# EAGLE design OSO-MISC-20-017 Parallel E-Paper Test Board 2 (EAGLE 9.6.2)
COMPANY: ADAFRUIT INDUSTRIES; DRAWN: KTOWN; REV: B
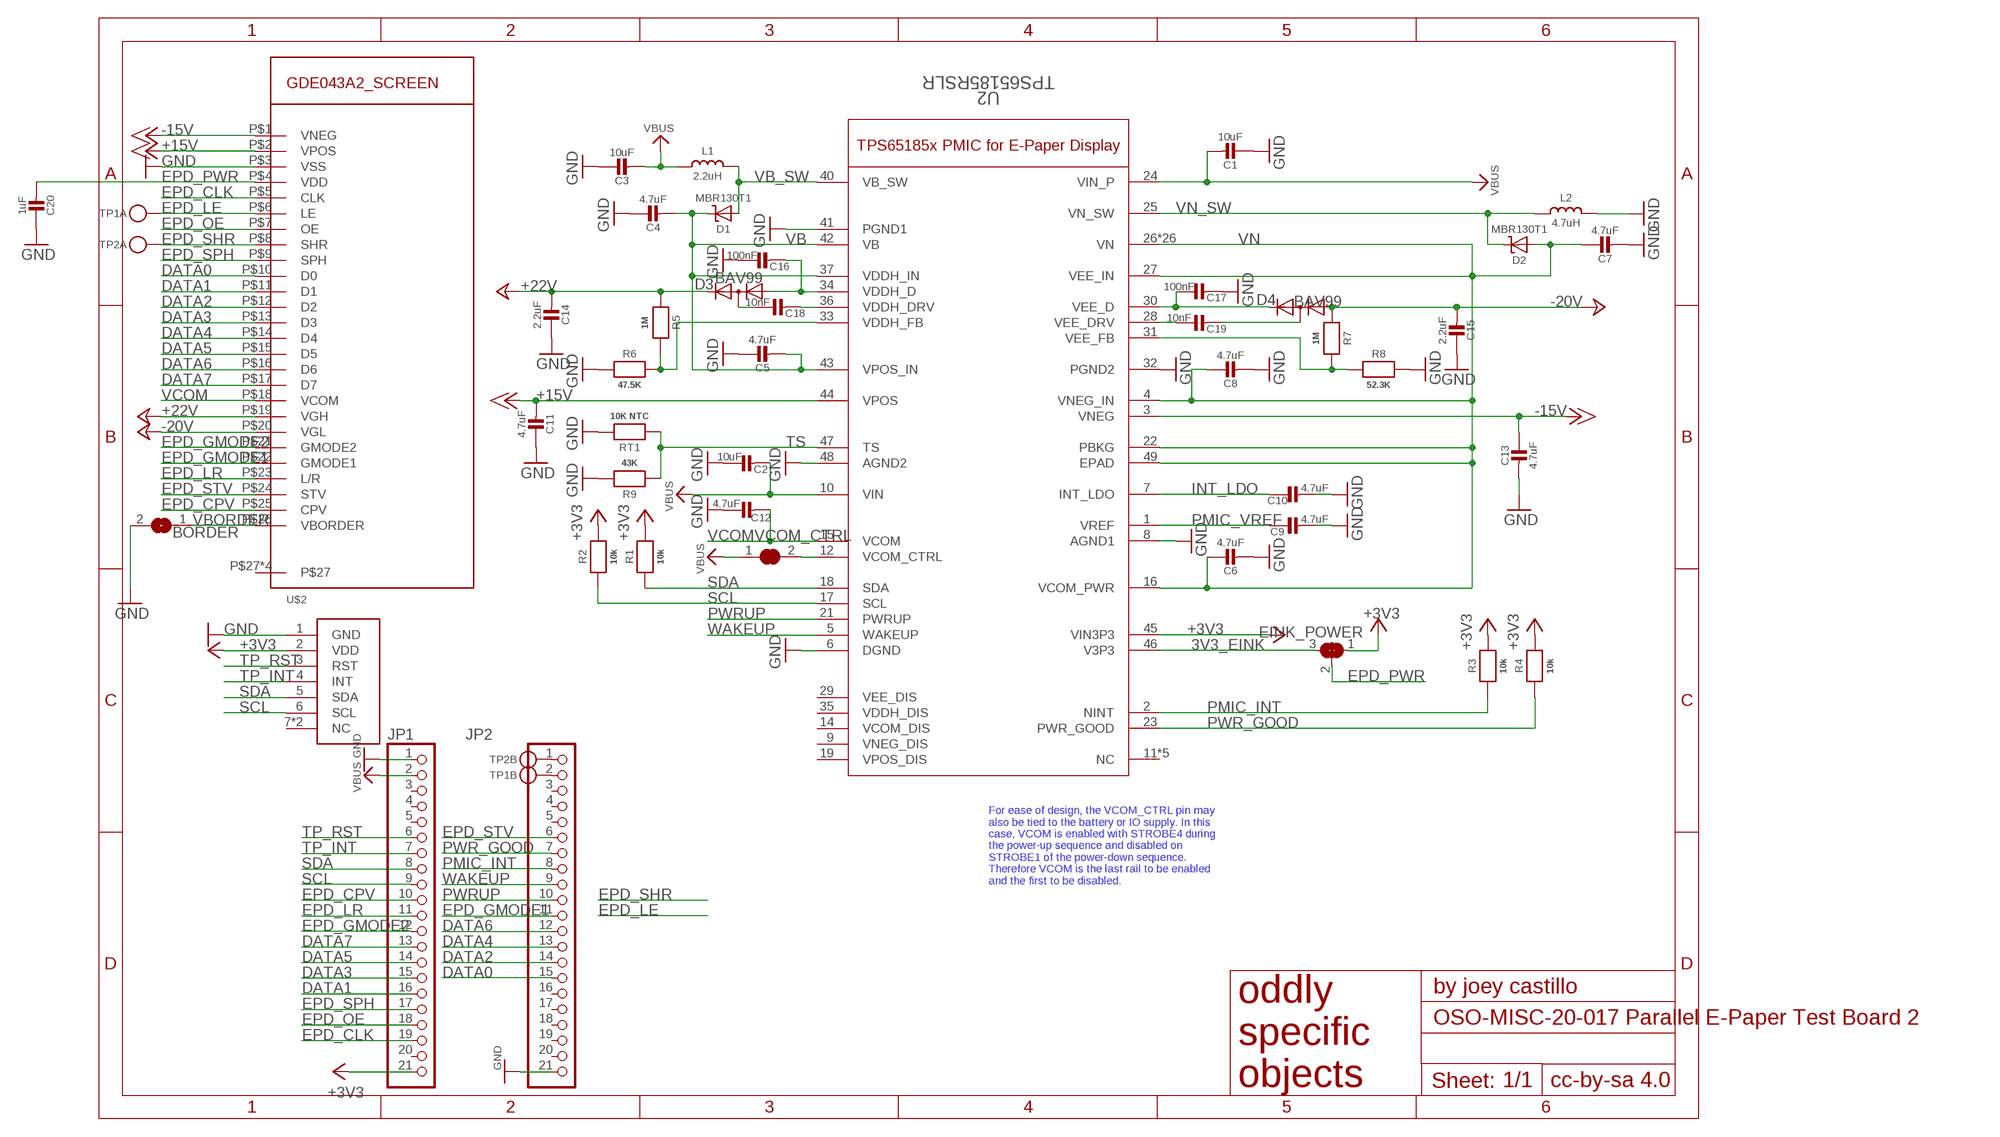
[diagram p0: schematic, sheet 1]

## Parts
BORDER  SJ  [SJ]
C1  10uF  CAP_CERAMIC0805-NOOUTLINE  [0805-NO]
C2  10uF  CAP_CERAMIC0805-NOOUTLINE  [0805-NO]
C3  10uF  CAP_CERAMIC0805-NOOUTLINE  [0805-NO]
C4  4.7uF  CAP_CERAMIC0805-NOOUTLINE  [0805-NO]
C5  4.7uF  CAP_CERAMIC0805-NOOUTLINE  [0805-NO]
C6  4.7uF  CAP_CERAMIC0805-NOOUTLINE  [0805-NO]
C7  4.7uF  CAP_CERAMIC0805-NOOUTLINE  [0805-NO]
C8  4.7uF  CAP_CERAMIC0805-NOOUTLINE  [0805-NO]
C9  4.7uF  CAP_CERAMIC0805-NOOUTLINE  [0805-NO]
C10  4.7uF  CAP_CERAMIC0805-NOOUTLINE  [0805-NO]
C11  4.7uF  CAP_CERAMIC0805-NOOUTLINE  [0805-NO]
C12  4.7uF  CAP_CERAMIC0805-NOOUTLINE  [0805-NO]
C13  4.7uF  CAP_CERAMIC0805-NOOUTLINE  [0805-NO]
C14  2.2uF  CAP_CERAMIC0805-NOOUTLINE  [0805-NO]
C15  2.2uF  CAP_CERAMIC0805-NOOUTLINE  [0805-NO]
C16  100nF  CAP_CERAMIC0805-NOOUTLINE  [0805-NO]
C17  100nF  CAP_CERAMIC0805-NOOUTLINE  [0805-NO]
C18  10nF  CAP_CERAMIC0805-NOOUTLINE  [0805-NO]
C19  10nF  CAP_CERAMIC0805-NOOUTLINE  [0805-NO]
C20  1uF  CAP_CERAMIC0805-NOOUTLINE  [0805-NO]
D1  MBR130T1  MICROBUILDER_DIODE-SCHOTTKYSOD-123  [MICROBUILDER_SOD-123]
D2  MBR130T1  MICROBUILDER_DIODE-SCHOTTKYSOD-123  [MICROBUILDER_SOD-123]
D3  BAV99  BAV199  [SOT23]
D4  BAV99  BAV199  [SOT23]
EINK_POWER  SOLDERJUMPER_2WAY  [SOLDERJUMPER_2WAY_OPEN_NOPASTE]
JP1  PINHD-1X21  [1X21]
JP2  PINHD-1X21  [1X21]
L1  2.2uH  MICROBUILDER_INDUCTORNR401_BIGPADS  [MICROBUILDER_INDUCTOR_4X4MM_NR401_BIGPADS]
L2  4.7uH  MICROBUILDER_INDUCTORNR401_BIGPADS  [MICROBUILDER_INDUCTOR_4X4MM_NR401_BIGPADS]
R1  10k  RESISTOR0805_NOOUTLINE  [0805-NO]
R2  10k  RESISTOR0805_NOOUTLINE  [0805-NO]
R3  10k  RESISTOR0805_NOOUTLINE  [0805-NO]
R4  10k  RESISTOR0805_NOOUTLINE  [0805-NO]
R5  1M  RESISTOR0805_NOOUTLINE  [0805-NO]
R6  47.5K  RESISTOR0805_NOOUTLINE  [0805-NO]
R7  1M  RESISTOR0805_NOOUTLINE  [0805-NO]
R8  52.3K  RESISTOR0805_NOOUTLINE  [0805-NO]
R9  43K  RESISTOR0805_NOOUTLINE  [0805-NO]
RT1  10K NTC  RESISTOR0805_NOOUTLINE  [0805-NO]
TP1A  TESTPOINT1.5X2.0MM_NOCREAM  [PAD-1.5X2.0]
TP1B  TESTPOINT1.5X2.0MM_NOCREAM  [PAD-1.5X2.0]
TP2A  TESTPOINT1.5X2.0MM_NOCREAM  [PAD-1.5X2.0]
TP2B  TESTPOINT1.5X2.0MM_NOCREAM  [PAD-1.5X2.0]
U2  TPS65185RSLR  [RSL48_4P4X4P4]
U$2  GDE043A2_TP  [GDE043A2_TP]
U$3  GDE043A2_SCREEN  [AXT526124]
VCOM_CTRL  MICROBUILDER_SOLDERJUMPER_CLOSED  [MICROBUILDER_SOLDERJUMPER_CLOSEDWIRE]

## Nets
3V3_EINK [power]: EINK_POWER.3 U2.46(V3P3)
+3V3 [power]: EINK_POWER.1 JP1.21 R1.2 R2.2 R3.2 R4.2 U2.45(VIN3P3) U$2.2(VDD)
+15V [power]: C11.2 U2.44(VPOS) U$3.P$2(VPOS)
+22V [power]: C14.2 D3.2(C) R5.1 U$3.P$19(VGH)
-15V [power]: C13.1 U2.3(VNEG) U$3.P$1(VNEG)
-20V [power]: C15.2 D4.1(A) R7.1 U$3.P$20(VGL)
DATA0: JP2.15 U$3.P$10(D0)
DATA1: JP1.16 U$3.P$11(D1)
DATA2: JP2.14 U$3.P$12(D2)
DATA3: JP1.15 U$3.P$13(D3)
DATA4: JP2.13 U$3.P$14(D4)
DATA5: JP1.14 U$3.P$15(D5)
DATA6: JP2.12 U$3.P$16(D6)
DATA7: JP1.13 U$3.P$17(D7)
EPD_CLK: JP1.19 U$3.P$5(CLK)
EPD_CPV: JP1.10 U$3.P$25(CPV)
EPD_GMODE1: JP2.11 U$3.P$22(GMODE1)
EPD_GMODE2: JP1.12 U$3.P$21(GMODE2)
EPD_LE: TP1A.P$1 U$3.P$6(LE)
EPD_LR: JP1.11 U$3.P$23(L/R)
EPD_OE: JP1.18 U$3.P$7(OE)
EPD_PWR: C20.2 EINK_POWER.2 U$3.P$4(VDD)
EPD_SHR: TP2A.P$1 U$3.P$8(SHR)
EPD_SPH: JP1.17 U$3.P$9(SPH)
EPD_STV: JP2.6 U$3.P$24(STV)
GND [gnd]: BORDER.2 C1.1 C2.1 C3.1 C4.1 C5.1 C6.2 C7.2 C8.2 C9.2 C10.2 C11.1 C12.1 C13.2 C14.1 C15.1 C16.1 C17.2 C20.1 JP1.1 JP2.21 L2.P$2 R6.1 R8.2 R9.2 RT1.2 U2.6(DGND) U2.8(AGND1) U2.32(PGND2) U2.41(PGND1) U2.48(AGND2) U$2.1(GND) U$3.P$3(VSS)
INT_LDO [power]: C10.1 U2.7(INT_LDO)
N$1: JP2.1 TP2B.P$1
N$2: JP2.2 TP1B.P$1
N$13 [power]: C18.1 D3.3(AC)
N$15 [power]: C19.2 D4.3(AC)
PMIC_INT: JP2.8 R3.1 U2.2(NINT)
PMIC_VREF [power]: C9.1 U2.1(VREF)
PWR_GOOD: JP2.7 R4.1 U2.23(PWR_GOOD)
PWRUP: JP2.10 U2.21(PWRUP)
SCL: JP1.9 R2.1 U2.17(SCL) U$2.6(SCL)
SDA: JP1.8 R1.1 U2.18(SDA) U$2.5(SDA)
TP_INT: JP1.7 U$2.4(INT)
TP_RST: JP1.6 U$2.3(RST)
TS: R9.1 RT1.1 U2.47(TS)
VB [power]: C4.2 C5.2 D1.C U2.37(VDDH_IN) U2.42(VB) U2.43(VPOS_IN)
VB_SW [power]: D1.A L1.P$2 U2.40(VB_SW)
VBORDER [power]: BORDER.1 U$3.P$26(VBORDER)
VBUS [power2]: C1.2 C2.2 C3.2 JP1.2 L1.P$1 U2.10(VIN) U2.24(VIN_P) VCOM_CTRL.1
VCOM [power]: C12.2 U2.15(VCOM) U$3.P$18(VCOM)
VCOM_CTRL: U2.12(VCOM_CTRL) VCOM_CTRL.2
VDDH_D [power]: C16.2 D3.1(A) U2.34(VDDH_D)
VDDH_DRV [power]: C18.2 U2.36(VDDH_DRV)
VDDH_FB [power]: R5.2 R6.2 U2.33(VDDH_FB)
VEE_D [power]: C17.1 D4.2(C) U2.30(VEE_D)
VEE_DRV [power]: C19.1 U2.28(VEE_DRV)
VEE_FB [power]: R7.2 R8.1 U2.31(VEE_FB)
VN [power]: C6.1 C7.1 C8.1 D2.A U2.4(VNEG_IN) U2.16(VCOM_PWR) U2.22(PBKG) U2.26(VN) U2.27(VEE_IN) U2.49(EPAD) U2.P$1(VN) U2.P$2(VN) U2.P$3(VN) U2.P$4(VN) U2.P$5(VN) U2.P$6(VN) U2.P$7(VN) U2.P$8(VN) U2.P$9(VN) U2.P$10(VN) U2.P$11(VN) U2.P$12(VN) U2.P$13(VN) U2.P$14(VN) U2.P$15(VN) U2.P$16(VN) U2.P$17(VN) U2.P$18(VN) U2.P$19(VN) U2.P$20(VN) U2.P$21(VN) U2.P$22(VN) U2.P$23(VN) U2.P$24(VN) U2.P$25(VN)
VN_SW [power]: D2.C L2.P$1 U2.25(VN_SW)
WAKEUP: JP2.9 U2.5(WAKEUP)
Unconnected: JP1.3 JP1.4 JP1.5 JP1.20 JP2.3 JP2.4 JP2.5 JP2.16 JP2.17 JP2.18 JP2.19 JP2.20 U2.9(VNEG_DIS) U2.11(NC) U2.13(NC) U2.14(VCOM_DIS) U2.19(VPOS_DIS) U2.20(NC) U2.29(VEE_DIS) U2.35(VDDH_DIS) U2.38(NC) U2.39(NC) U$2.7(NC) U$2.8(NC) U$3.P$27 U$3.P$28 U$3.P$29 U$3.P$30

## Notes on the sheet
- For ease of design, the VCOM_CTRL pin may 
  also be tied to the battery or IO supply. In this 
  case, VCOM is enabled with STROBE4 during 
  the power-up sequence and disabled on
  STROBE1 of the power-down sequence.
  Therefore VCOM is the last rail to be enabled 
  and the first to be disabled.

## Library data of the parts
BORDER = jumper:SJ: SMD solder JUMPER
C1-C3 C6-C10 C13 C16-C20 = microbuilder:CAP_CERAMIC: Ceramic Capacitors For new designs, use the packages preceded by an '_' character since they are more reliable: The following footprints should be used on most boards: _0402 - Standard footprint for regular board layouts _0603 - Standard footprint for regular board layouts _0805 - Standard footprint for regular board layouts _1206 - Standard footprint for regular board layouts For extremely tight-pitch boards where space is at a premium, the following 'micro-pitch' footprints can be used (smaller pads, no silkscreen outline, etc.): _0402MP - Micro-pitch footprint for very dense/compact boards _0603MP - Micro-pitch footprint for very dense/compact boards _0805MP - Micro-pitch footprint for very dense/compact boards _1206MP - Micro-pitch footprint for very dense/compact boards
C4 C5 C11 C12 C14 C15 = microbuilder:CAP_CERAMIC: Ceramic Capacitors For new designs, use the packages preceded by an '_' character since they are more reliable: The following footprints should be used on most boards: _0402 - Standard footprint for regular board layouts _0603 - Standard footprint for regular board layouts _0805 - Standard footprint for regular board layouts _1206 - Standard footprint for regular board layouts For extremely tight-pitch boards where space is at a premium, the following 'micro-pitch' footprints can be used (smaller pads, no silkscreen outline, etc.): _0402MP - Micro-pitch footprint for very dense/compact boards _0603MP - Micro-pitch footprint for very dense/compact boards _0805MP - Micro-pitch footprint for very dense/compact boards _1206MP - Micro-pitch footprint for very dense/compact boards; SPICEPREFIX: C
D1 D2 = Adafruit Feather M0 Express:MICROBUILDER_DIODE-SCHOTTKY
D3 D4 = diode:BAV199: DIODE low-leakage double diode
EINK_POWER = Adafruit MONSTER M4SK:SOLDERJUMPER_2WAY: 2-Way Solder Jumper
JP1 JP2 = oddlyspecific:PINHD-1X21: PIN HEADER
L1 L2 = Adafruit 3.5in 480x320 FeatherWing:MICROBUILDER_INDUCTOR: Inductors 0603: 10nH Ceramic Inductor - microwire antenna/RF (Digikey: 712-1434-2-ND) 0805: 560nH Ceramic Inductor - RF (Digikey: 553-1047-1-ND) 270nH Ceramic Inductor - Q = 40@250MHz, +-5%, 1 Ohm DC Resistance (Digikey: 535-10506-2-ND) 1007 (2518 Metric) SMT: 10µH 10% 250mOhm 820mA 1007 Inductor (Digikey: 587-2189-1-ND) 22µH 10% 500mOhm 580mA 1007 Inductor (Digikey: 587-2190-1-ND) 47µH 10% 950mOhm 420mA 1007 Inductor (Digikey: 587-2191-1-ND) 47µH 5% 100mOhm 1A 1008 Inductor (Digikey: 732-1816-1-ND) 5.0x5.0mm (Taiyo Yuden NR5040 Series) 6.8µH 20% 2.3A 64mOhm Inductor (Digikey: 587-2374-2-ND) 5.0x5.0mm (TDK VLC5045 Series) 4.7µH 20% 3.3A 34mOhm Inductor (Digikey: 445-6526-1-ND) 6.8µH 20% 2.7A 46mOhm Inductor (Digikey: 445-6527-1-ND) 6.0x6.0mm (TDK VLC6045 Series) 4.7µH 20% 3.8A 27mOhm Inductor (Digikey: 445-6538-2-ND) 6.8µH 20% 3A 41mOhm Inductor (Digikey: 445-6540-1-ND) 6.2µH 30% 2.2A 45mOhm Inductor (Digikey: SRR5028-6R2YCT-ND) - Not TDK VLC6045 but footprint should match 6.0x6.0mm (TDK SLF6045 Series) 6.8uH 30% 2A 33mOhm Inductor (Digikey: 445-4572-1-ND, Mouser: 810-SLF645T6R8N2R0PF) 6.0x6.0mm (Sumida CDRH5D28 Series) 6.2uH 30% 1.8A 45mOhm Inductor (Digikey: 308-1542-1-ND) Taiyo Yuden NR3015T2R2M - 2.2uH 20% 1.5A (Digikey: 587-1648-2-ND, Mouser: 963-NR3015T2R2M) - Used with TI TPS62172 CoilCraft RFID Transponder Coil - MA5532-AE (For use with AS3935 Lightning Sensor) Taiyo Yuden NRH2412T2R2MNGH - 2.2uH 20% 1AA (Digikey: 587-3443-1-ND) - Used with TI LM3671 Vishay IHLP 1.0uH Molded Inductor - 24mOhm DCR, 5A, +/-20%, -55°C-125°C (Digikey: 541-1319-1-ND)
R1-R9 RT1 = microbuilder:RESISTOR: Resistors For new designs, use the packages preceded by an '_' character since they are more reliable: The following footprints should be used on most boards: _0402 - Standard footprint for regular board layouts _0603 - Standard footprint for regular board layouts _0805 - Standard footprint for regular board layouts _1206 - Standard footprint for regular board layouts For extremely tight-pitch boards where space is at a premium, the following 'micro-pitch' footprints can be used (smaller pads, no silkscreen outline, etc.): _0402MP - Micro-pitch footprint for very dense/compact boards _0603MP - Micro-pitch footprint for very dense/compact boards _0805MP - Micro-pitch footprint for very dense/compact boards _1206MP - Micro-pitch footprint for very dense/compact boards
TP1A TP1B TP2A TP2B = Adafruit MONSTER M4SK:TESTPOINT: Test Point Various test points for characterisation and PCB testing TESTPOINT_SMT - Compact Surface Mount Test Point [Digikey: 5016KTR-ND]
U2 = oddlyspecific:TPS65185RSLR; BUILT_BY: EMA_UL_Team; MANUFACTURER: Texas Instruments; MANUFACTURER_PART_NUMBER: TPS65185RSLR; VENDOR: Texas Instruments
U$2 = oddlyspecific:GDE043A2_TP
U$3 = oddlyspecific:GDE043A2_SCREEN
VCOM_CTRL = Adafruit 3.5in 480x320 FeatherWing:MICROBUILDER_SOLDERJUMPER_CLOSED: Solder Jumper - Closed These solder jumpers are closed by default CLOSEDWIRE - 10 mil trace between pads that can be cut and resoldered later CLOSEDPERM - 63 mil trace between pads for a permanent connection (used to 'bridge' two signals, a shameless hack for Eagle). Can double as a test point as well (no cream layer)

## Net classes
0 default: width 0.203 mm, drill 0.254 mm
1 power: width 0.203 mm, drill 0.254 mm
2 gnd: width 0.254 mm, drill 0.254 mm
3 power2: width 0.254 mm

## Board
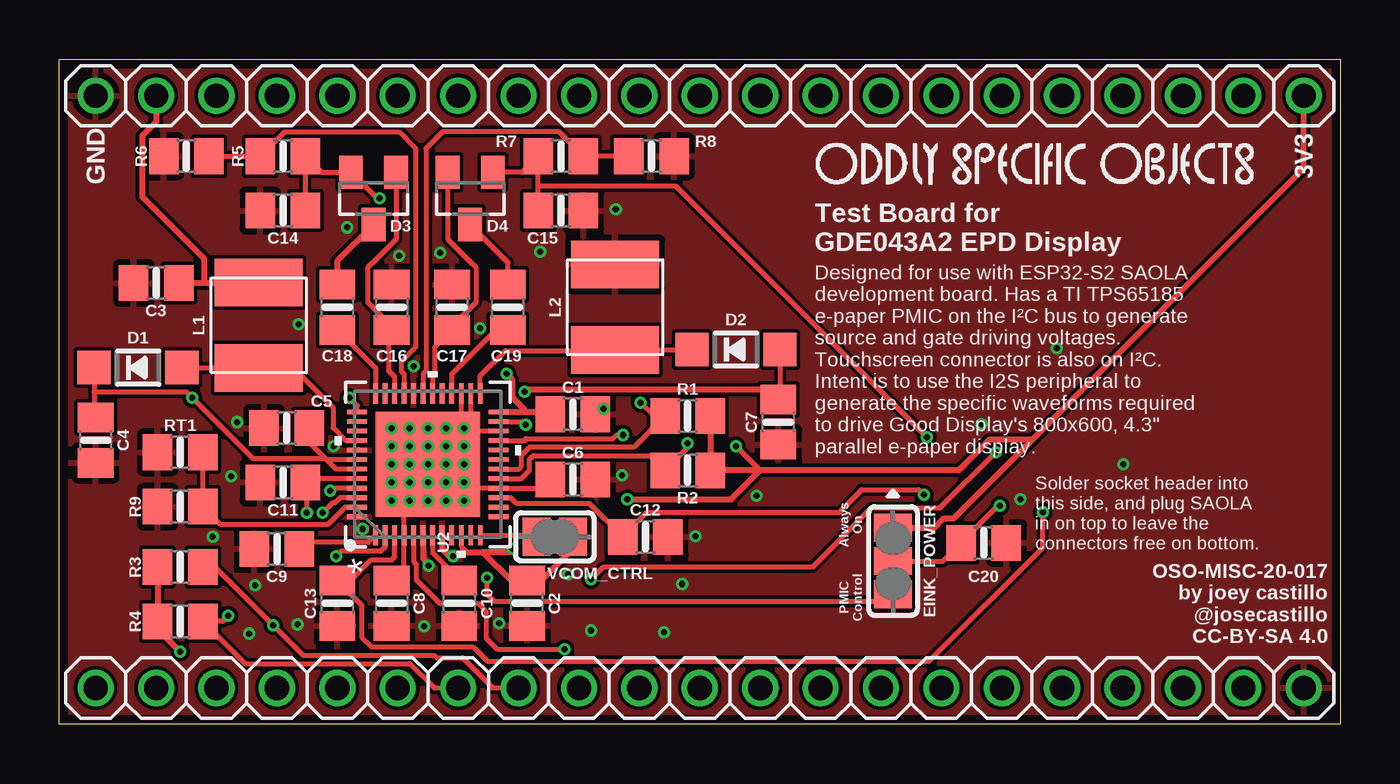
[diagram p1: board, top side]
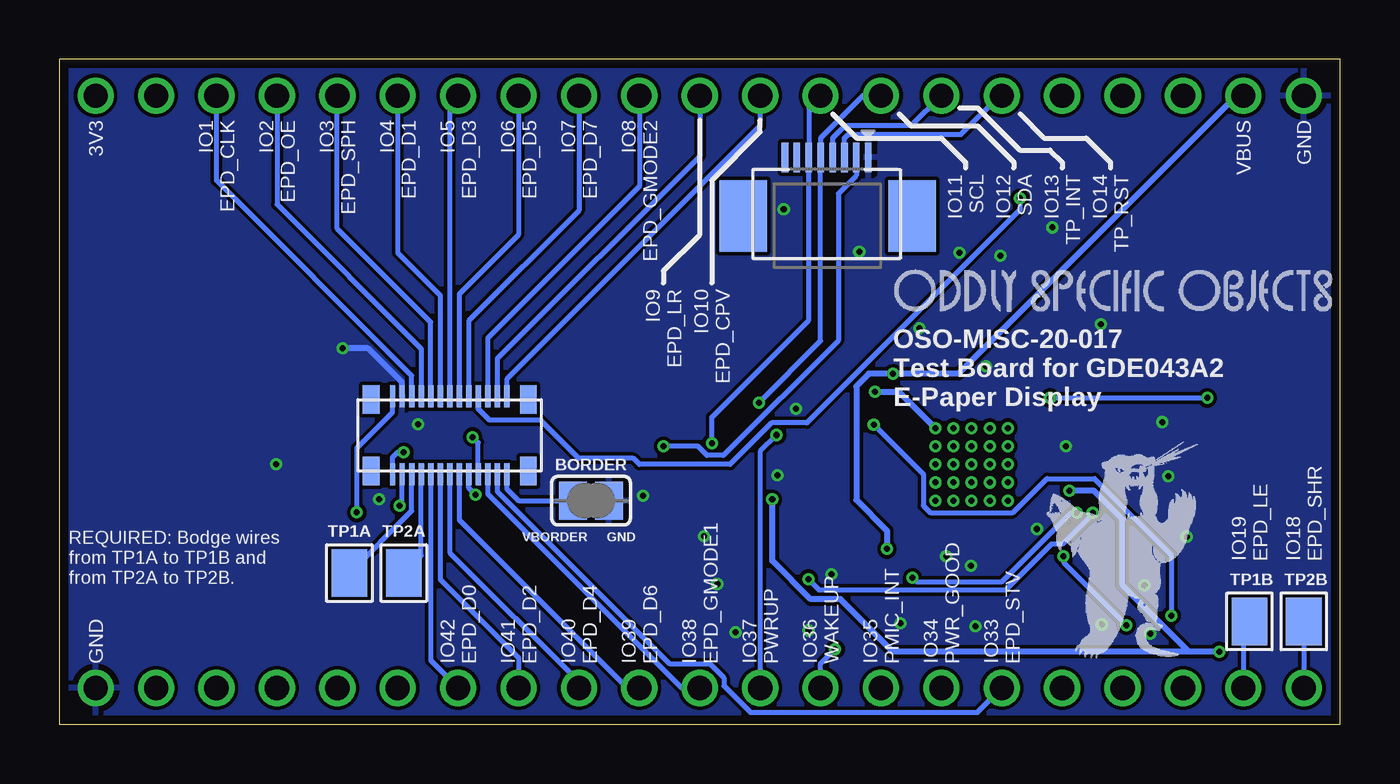
[diagram p2: board, bottom side, seen from below]

Size 53.85 x 27.94 mm. Coordinates in mm from the lower left corner, seen from the top.
Outline: 0,0 0,27.94 53.85,27.94 53.85,0 0,0
Copper layers (1*16): Top 0.035559375mm / dielectric 1.6mm / Bottom 0.035559375mm
Design rules "oshpark-2layer *": minimum track width 6mil, minimum drill 10mil, track to track 6mil, track to pad 6mil, pad to pad 6mil, via to via 6mil, smd to smd 6mil, copper to edge 15mil, drill to drill 6mil, minimum pad ring 5mil, minimum via ring 5mil, stop-mask expansion 2.5mil, vias tented up to drill 12mil, thermal gap 10mil

### Footprints (pad centres in the part's own frame; a part is rotated, then mirrored left to right if it is on the bottom)
SJ = smd 1.168 x 1.6: 1 -0.762,0; 2 0.762,0
0805-NO = smd 1.24 x 1.5: 1 -0.95,0; 2 0.95,0
MICROBUILDER_SOD-123 = smd 1.4 x 1.4: A 1.85,0; C -1.85,0
SOT23 = smd 1 x 1.4: 1 -0.95,-1.1; 2 0.95,-1.1; 3 0,1.1
SOLDERJUMPER_2WAY_OPEN_NOPASTE = smd 1.168 x 1.6: 1 -1.397,0; 2 0,0; 3 1.397,0
1X21 = drill 1.016: 1 -25.4,0; 2 -22.86,0; 3 -20.32,0; 4 -17.78,0; 5 -15.24,0; 6 -12.7,0; 7 -10.16,0; 8 -7.62,0; 9 -5.08,0; 10 -2.54,0; 11 0,0; 12 2.54,0; 13 5.08,0; 14 7.62,0; 15 10.16,0; 16 12.7,0; 17 15.24,0; 18 17.78,0; 19 20.32,0; 20 22.86,0; 21 25.4,0
MICROBUILDER_INDUCTOR_4X4MM_NR401_BIGPADS = smd 2 x 3.7: P$1 -1.8,0; P$2 1.8,0
PAD-1.5X2.0 = smd 1.5 x 2: P$1 0,0
RSL48_4P4X4P4 = smd 0.85 x 0.2: 1 -2.975,2.2; 2 -2.975,1.8; 3 -2.975,1.4; 4 -2.975,1; 5 -2.975,0.6; 6 -2.975,0.2; 7 -2.975,-0.2; 8 -2.975,-0.6; 9 -2.975,-1; 10 -2.975,-1.4; 11 -2.975,-1.8; 12 -2.975,-2.2; 25 2.975,-2.2; 26 2.975,-1.8; 27 2.975,-1.4; 28 2.975,-1; 29 2.975,-0.6; 30 2.975,-0.2; 31 2.975,0.2; 32 2.975,0.6; 33 2.975,1; 34 2.975,1.4; 35 2.975,1.8; 36 2.975,2.2 | smd 0.2 x 0.85: 13 -2.2,-2.975; 14 -1.8,-2.975; 15 -1.4,-2.975; 16 -1,-2.975; 17 -0.6,-2.975; 18 -0.2,-2.975; 19 0.2,-2.975; 20 0.6,-2.975; 21 1,-2.975; 22 1.4,-2.975; 23 1.8,-2.975; 24 2.2,-2.975; 37 2.2,2.975; 38 1.8,2.975; 39 1.4,2.975; 40 1,2.975; 41 0.6,2.975; 42 0.2,2.975; 43 -0.2,2.975; 44 -0.6,2.975; 45 -1,2.975; 46 -1.4,2.975; 47 -1.8,2.975; 48 -2.2,2.975 | smd 4.4 x 4.4: 49 0,0 | drill 0.254 pad 0.508: P$1 -1.524,1.524; P$2 -0.762,1.524; P$3 0,1.524; P$4 0.762,1.524; P$5 1.524,1.524; P$6 -1.524,0.762; P$7 -0.762,0.762; P$8 0,0.762; P$9 0.762,0.762; P$10 1.524,0.762; P$11 -1.524,0; P$12 -0.762,0; P$13 0,0; P$14 0.762,0; P$15 1.524,0; P$16 -1.524,-0.762; P$17 -0.762,-0.762; P$18 0,-0.762; P$19 0.762,-0.762; P$20 1.524,-0.762; P$21 -1.524,-1.524; P$22 -0.762,-1.524; P$23 0,-1.524; P$24 0.762,-1.524; P$25 1.524,-1.524
GDE043A2_TP = smd 0.275 x 1.25: 1 1.75,2.46; 2 1.25,2.46; 3 0.75,2.46; 4 0.25,2.46; 5 -0.25,2.46; 6 -0.75,2.46; 7 -1.25,2.46; 8 -1.75,2.46 | smd 2 x 3: SPRT3 3.6,0; SPRT4 -3.51,0
AXT526124 = smd 0.23 x 0.92: P$1 -2.4,1.65; P$2 -2.4,-1.63; P$3 -2,1.65; P$4 -2,-1.63; P$5 -1.6,1.65; P$6 -1.6,-1.63; P$7 -1.2,1.65; P$8 -1.2,-1.63; P$9 -0.8,1.65; P$10 -0.8,-1.63; P$11 -0.4,1.65; P$12 -0.4,-1.63; P$13 0,1.65; P$14 0,-1.63; P$15 0.4,1.65; P$16 0.4,-1.63; P$17 0.8,1.65; P$18 0.8,-1.63; P$19 1.2,1.65; P$20 1.2,-1.63; P$21 1.6,1.65; P$22 1.6,-1.63; P$23 2,1.65; P$24 2,-1.63; P$25 2.4,1.65; P$26 2.4,-1.63 | smd 0.7 x 1.2: P$27 -3.3,1.5; P$28 -3.3,-1.5; P$29 3.3,1.5; P$30 3.3,-1.5
MICROBUILDER_SOLDERJUMPER_CLOSEDWIRE = smd 1.168 x 1.6: 1 -0.762,0; 2 0.762,0 | smd 0.635 x 0.203: WIRE 0,0

### Placement (x,y rotation side)
BORDER  31.5,9.4 0 bottom
C1  21.59,13.03 180 top
C2  19.66,5.08 90 top
C3  4.06,18.54 0 top
C4  1.52,11.94 90 top
C5  9.55,12.45 0 top
C6  21.59,10.29 0 top
C7  30.23,12.7 270 top
C8  13.97,5.08 270 top
C9  9.14,7.37 180 top
C10  16.81,5.08 270 top
C11  9.4,10.16 0 top
C12  24.64,7.87 180 top
C13  11.68,5.08 270 top
C14  9.4,21.59 0 top
C15  21.08,21.59 180 top
C16  13.97,17.53 270 top
C17  16.51,17.53 90 top
C18  11.68,17.53 270 top
C19  18.85,17.53 90 top
C20  38.86,7.62 180 top
D1  3.3,14.99 0 top
D2  28.45,15.75 0 top
D3  13.21,22.1 180 top
D4  17.27,22.1 180 top
EINK_POWER  35.05,6.86 270 top
JP1  26.92,26.42 0 top
JP2  26.92,1.52 0 top
L1  8.38,16.76 270 top
L2  23.37,17.53 90 top
R1  26.42,12.95 0 top
R2  26.42,10.67 0 top
R3  5.08,6.6 180 top
R4  5.08,4.32 180 top
R5  9.4,23.88 180 top
R6  5.33,23.88 0 top
R7  21.08,23.88 0 top
R8  24.89,23.88 0 top
R9  5.08,9.14 180 top
RT1  5.08,11.43 180 top
TP1A  41.66,6.35 180 bottom
TP1B  3.81,4.32 0 bottom
TP2A  39.37,6.35 180 bottom
TP2B  1.52,4.32 0 bottom
U2  15.49,10.92 90 top
U$2  21.59,21.36 0 bottom
U$3  37.44,12.14 0 bottom
U$4  [OSO_BEAR_250X360MIL_1000DPI]  9.14,7.37 0 bottom
U$10  [OSO_WORDMARK_ONELINE_725MIL_1000DPI]  18.8,17.27 0 bottom
U$11  [OSO_WORDMARK_ONELINE_725MIL_1000DPI]  31.75,22.61 0 top
VCOM_CTRL  20.83,7.87 180 top

### Tracks (layer width: path | path; a pad name or v marks a point on that pad's centre or on a via)
3V3_EINK  (via drill 0.25)
  Top 0.203: U2.46 11.8,9.52 11.59,9.31 11.48,9.31 v11.06,8.89 | v17.98,6.15 17.98,5.46 18.29,5.16 34.75,5.16 EINK_POWER.3
  Bottom 0.203: v11.06,8.89 11.32,8.89 14.22,5.99 17.83,5.99 v17.98,6.15
+3V3  (via drill 0.25)
  Top 0.203: U2.45 11.48,9.92 v11.37,9.81 | v28.45,11.68 29.46,10.67
  Top 0.254: JP1.21 52.32,23.37 40.92,11.96 | EINK_POWER.1 36.78,8.26 37.18,8.65 37.6,8.65 40.92,11.96 | 29.46,10.67 37.81,10.67 39.11,11.96 40.92,11.96 | 29.46,10.67 R2.2 R1.2 | R3.2 R4.2 4.13,4 v5.08,3.05 | v23.88,9.45 28.25,9.45 29.46,10.67
  Bottom 0.203: U$2.2 20.34,23.06 21.1,22.3 21.1,16.13 25.93,11.3 26.63,11.3 27.01,11.68 v28.45,11.68
  Bottom 0.254: v5.08,3.05 6.35,3.05 | v11.37,9.81 10.35,9.81 9.14,8.61 9.14,5.84 6.35,3.05 | 6.35,3.05 18.8,3.05 21.01,5.26 22.27,5.26 23.88,6.87 v23.88,9.45
+15V  (via drill 0.25)
  Top 0.203: U2.44 10.51,10.32 C11.2 10.4,10.1 v10.4,8.89 | v39.37,11.43 37.03,9.09 34.15,9.09 31.66,6.6 22.86,6.6 v22.35,6.1
  Bottom 0.203: v10.4,8.89 10.56,8.74 10.56,8.68 11.67,7.57 12.14,7.57 14.07,5.64 21.89,5.64 v22.35,6.1 | v39.37,11.43 39.62,11.43 39.84,11.21 U$3.P$2
+22V  (via drill 0.25)
  Top 0.203: C14.2 R5.1 11.03,23.2 D3.2 13.35,22.1 v13.46,22.1
  Bottom 0.203: v13.46,22.1 13.46,21.62 22.42,12.66 23.91,12.66 25.64,10.92 29.46,10.92 29.71,11.17 32.01,11.17 33.62,12.78 35.76,12.78 36.24,13.25 U$3.P$19
-15V  (via drill 0.25)
  Top 0.203: U2.3 14.09,7.03 13.97,6.9 13.12,6.9 12.24,6.03 C13.1 12.71,5 12.71,3.66 13.12,3.25 17.39,3.25 18,2.64 36.56,2.64 41.35,7.42 v41.35,8.9
  Bottom 0.203: v41.35,8.9 v41.34,8.9 41.34,11.6 39.84,13.1 U$3.P$1
-20V  (via drill 0.25)
  Top 0.203: D4.1 19.45,23.2 R7.1 20.13,22.61 | C15.2 20.13,22.61 | v36.47,12.06 25.93,22.61 20.13,22.61
  Bottom 0.203: U$3.P$20 36.24,11.83 v36.47,12.06
DATA0
  Bottom 0.203: U$3.P$10 38.24,2.68 JP2.15
DATA1
  Bottom 0.203: JP1.16 39.62,19.81 37.84,18.03 U$3.P$11
DATA2
  Bottom 0.203: U$3.P$12 37.84,6.09 34.54,2.79 JP2.14
DATA3
  Bottom 0.203: U$3.P$13 37.44,26.19 37.21,26.42 JP1.15
DATA4
  Bottom 0.203: U$3.P$14 37.44,7.21 32,1.78 JP2.13
DATA5
  Bottom 0.203: JP1.14 34.54,20.57 37.04,18.08 U$3.P$15
DATA6
  Bottom 0.203: U$3.P$16 37.04,8.59 29.97,1.52 JP2.12
DATA7
  Bottom 0.203: JP1.13 32,21.59 36.64,16.95 U$3.P$17
EPD_CLK
  Bottom 0.203: U$3.P$5 39.04,14.66 47.24,22.86 JP1.19
EPD_CPV
  Bottom 0.203: JP1.10 24.38,25.15 35.04,14.49 U$3.P$25
EPD_GMODE1
  Bottom 0.203: U$3.P$22 35.84,9.68 27.69,1.52 JP2.11
EPD_GMODE2
  Bottom 0.203: JP1.12 29.46,22.61 35.84,16.23 U$3.P$21
EPD_LE
  Bottom 0.203: TP1A.P$1 39.04,8.97 U$3.P$6
EPD_LR
  Bottom 0.203: JP1.11 26.92,23.88 35.44,15.36 U$3.P$23
EPD_OE
  Bottom 0.203: JP1.18 44.7,21.84 38.64,15.78 U$3.P$7
EPD_PWR  (via drill 0.25)
  Top 0.203: v39.55,9.18 39.47,9.18 C20.2 37.15,6.86 EINK_POWER.2
  Top 0.254: EINK_POWER.2 35.05,8.38
  Bottom 0.203: v39.55,9.18 39.44,9.29 U$3.P$4
EPD_SHR
  Bottom 0.203: TP2A.P$1 38.64,7.08 U$3.P$8
EPD_SPH
  Bottom 0.203: U$3.P$9 38.24,16.9 42.16,20.83 JP1.17
EPD_STV
  Bottom 0.203: U$3.P$24 35.44,9.79 28.19,2.54 26.5,2.54 25.91,1.95 25.91,1.61 24.78,0.48 15.24,0.48 15.24,0.51 JP2.6
GND  (via drill 0.25)
  Top 0.254: U2.8 16.09,7.38 16.41,7.06 v16.56,7.06 | U2.6 15.29,6.97 15.38,6.89 15.38,6.79 v15.52,6.66
  Bottom 0.254: U$3.P$3 39.45,14.37 40.88,15.8 v41.94,15.8
  other vias: 16,19.81 14.27,19.68 14.88,15.04 10.06,16.81 12.09,20.88 11.53,11.68 7.47,12.7 7.21,10.41 6.45,7.87 8.23,5.84 15.34,4.11 10.01,4.19 22.35,3.94 25.43,3.86 26.19,5.89 26.75,7.9 23.65,10.46 22.89,13.26 12.75,8.2 40.41,9.45 38.76,12.6 44.73,10.92 23.39,21.64 20.22,19.86 17.68,16.64 21.39,6.3 18.49,4.24 7.98,3.81 29.31,9.6
  pour Top: 0,27.94 0,0 53.98,0 53.98,27.94
  pour Bottom: 0,0 53.98,0 53.98,27.94 0,27.94
INT_LDO
  Top 0.203: U2.7 15.69,7.2 16.82,6.08 C10.1
N$1
  Bottom 0.203: TP2B.P$1 JP2.1
N$2
  Bottom 0.203: TP1B.P$1 4.06,4.06 JP2.2
N$13
  Top 0.254: D3.3 11.68,19.47 C18.1
N$15
  Top 0.203: D4.3 18.85,19.42 C19.2
PMIC_INT  (via drill 0.25)
  Top 0.203: R3.1 6.54,6.6 v8.98,4.16 10.25,2.9 15.77,2.9 15.87,2.79 16.94,2.79 18.21,1.52 JP2.8 | U2.2 13.69,7.46 13.5,7.27 11.84,7.27 v11.63,7.06
  Bottom 0.203: v11.63,7.06 11.63,6.81 v8.98,4.16
PMIC_VREF
  Top 0.203: U2.1 12.99,7.64 10.37,7.64 C9.1
PWR_GOOD  (via drill 0.25)
  Top 0.203: U2.23 19.48,12.72 v19.61,12.59 | JP2.7 15.75,1.52 14.73,2.54 7.81,2.54 R4.1 6.87,4.32 v7.1,4.55 v7.1,4.56
  Bottom 0.203: v19.61,12.59 17.53,10.51 17.53,9.19 17.23,8.89 13.76,8.89 12.33,10.32 10.32,10.32 7.1,7.1 v7.1,4.56
PWRUP  (via drill 0.25)
  Top 0.203: U2.21 19.54,11.92 19.62,12 23.29,12 23.44,12.15 v23.69,12.15
  Bottom 0.203: v23.69,12.15 24.38,11.46 JP2.10
SCL  (via drill 0.25)
  Top 0.203: U2.17 19.42,10.32 19.77,10.67 19.77,11.14 19.91,11.29 24.84,11.29 R2.1 26.42,11.62 v26.42,11.81
  Bottom 0.203: JP1.9 22.34,25.92 U$2.6 22.34,16.99 26.42,12.91 v26.42,11.81
SDA  (via drill 0.25)
  Top 0.203: U2.18 19.32,10.72 19.41,10.81 19.41,11.29 19.77,11.65 24.16,11.65 R1.1 24.99,12.95 v24.43,13.51
  Bottom 0.203: JP1.8 20.07,26.42 21.84,24.64 U$2.5 21.84,16.11 v24.43,13.51
TP_INT
  Bottom 0.203: JP1.7 18.03,25.15 20.83,25.15 21.34,24.63 U$2.4
TP_RST
  Bottom 0.203: JP1.6 14.31,26.42 15.94,24.79 20.68,24.79 20.84,24.63 U$2.3
TS
  Top 0.203: U2.47 12.01,9.12 11.27,8.38 6.79,8.38 R9.1 RT1.1
VB  (via drill 0.25)
  Top 0.203: U2.43 11.63,10.72 11.23,11.12 | C5.2 10.5,11.85 11.18,11.18 | 11.23,11.12 11.18,11.18 | U2.42 11.23,11.12 | D1.C 1.45,13.97 | 1.45,13.97 1.45,12.96 C4.2 | 1.45,13.97 5.33,13.97 v5.59,13.72 8.13,11.18 11.18,11.18 | U2.37 12.52,13.39 v12.19,13.72
  Bottom 0.203: v12.19,13.72 v5.59,13.72
VB_SW
  Top 0.203: D1.A 8.36,14.99 L1.P$2 9.84,14.96 11.5,13.3 11.5,12.46 12.04,11.92 U2.40
VBORDER
  Bottom 0.203: U$3.P$26 35.04,9.89 34.54,9.4 BORDER.1
VBUS  (via drill 0.25)
  Top 0.203: U2.10 16.89,7.46 17.12,7.23
  Top 0.254: U2.24 19.56,13.12 | 19.56,13.12 20.55,13.12 C1.2 | v18.8,14.73 19.02,14.5 19.02,13.75 19.56,13.22 19.56,13.12 | JP1.2 4.06,25.32 3.48,24.74 3.48,22.17 6.1,19.56 6.1,18.54 | 6.1,18.54 C3.2 | L1.P$1 8.36,18.54 6.1,18.54 | 17.12,7.23 17.8,7.23 | 17.8,7.23 19,6.03 C2.2 20.25,6.03 21.59,7.37 VCOM_CTRL.1 | v19.05,7.37 18.92,7.23 17.8,7.23
  Bottom 0.254: JP1.2 4.37,26.42 16.05,14.73 v18.8,14.73 19.81,14.73 20.34,14.2 20.34,9.42 19.05,8.13 v19.05,7.37
VCOM  (via drill 0.25)
  Top 0.203: U2.15 18.98,9.52 19.23,9.27 22.29,9.27 C12.2 24.72,8.9 32.79,8.9 33.74,9.86 36.14,9.86 v36.35,9.64
  Bottom 0.203: v36.35,9.64 36.64,9.94 U$3.P$18
VCOM_CTRL
  Top 0.203: U2.12 19.99,7.95 VCOM_CTRL.2
VDDH_D
  Top 0.203: U2.34 14.09,14.61 13.84,14.86 13.84,16.45 C16.2 13.97,16.73 12.97,17.73 12.97,19.2 13.12,19.35 14.16,20.39 D3.1
VDDH_DRV
  Top 0.203: C18.2 13.29,14.97 U2.36
VDDH_FB
  Top 0.203: R6.2 R5.2 9.46,24.89 14.28,24.89 14.98,24.19 14.98,15.86 14.37,15.24 14.37,14.84 14.49,14.71 U2.33
VEE_D
  Top 0.203: U2.30 15.69,14.61 15.77,14.68 15.77,15.84 C17.1 16.51,16.73 17.51,17.73 17.51,19.2 17.36,19.35 16.32,20.39 D4.2
VEE_DRV
  Top 0.203: C19.1 18.35,16.58 16.49,14.72 U2.28
VEE_FB
  Top 0.203: R8.1 R7.2 21.02,24.89 16.1,24.89 15.41,24.21 15.41,14.85 15.29,14.73 U2.31
VN  (via drill 0.25)
  Top 0.203: U2.27 16.89,12.57 U2.P$25 | U2.26 17.29,12.72 U2.P$25 | U2.22 17.14,12.32 U2.P$25 | C8.1 14.49,6.55 U2.4 14.49,9.16 U2.P$6 U2.P$12 | C6.1 20.27,9.92 U2.16 17.26,9.92 U2.P$22 U2.P$18 | D2.A 30.3,13.79 30.19,13.68 | U2.P$8 U2.P$4 U2.P$9 | U2.P$8 U2.P$3 | U2.P$8 U2.P$2 | U2.P$1 U2.P$7 U2.P$13 | U2.P$14 U2.P$15 | U2.P$14 U2.P$20 U2.P$19 | U2.P$19 U2.P$25 | U2.P$19 U2.P$24 | U2.P$18 U2.P$23 | U2.P$21 U2.P$17 U2.P$13 | U2.P$13 U2.P$18 | U2.P$13 U2.P$19 | U2.P$13 U2.P$14 | U2.P$13 U2.P$8 | U2.P$13 U2.P$9 | U2.P$9 U2.P$10 | U2.P$13 U2.P$5 | U2.P$12 U2.P$11 | U2.P$12 U2.P$16 | U2.P$13 U2.P$12
  Top 0.254: v19.56,13.97 19.65,14.06 29.82,14.06 30.19,13.68 C7.1
  Bottom 0.254: v19.56,13.97 18.54,13.97 U2.P$25
VN_SW
  Top 0.203: U2.25 17.69,14.65 18.75,15.7 22.45,15.7 22.47,15.73 L2.P$1 26.58,15.73 D2.C
WAKEUP  (via drill 0.25)
  Top 0.203: U2.5 14.89,6.83 15,6.73 15,6.07 15.98,5.08 17.59,5.08 17.94,4.73 17.94,3.61 18.4,3.15 v21.23,3.15
  Bottom 0.203: JP2.9 21.84,2.54 v21.23,3.15

### Text on the board
tPlace: GND | 3V3 | Test Board for / GDE043A2 EPD Display | Designed for use with ESP32-S2 SAOLA / development board. Has a TI TPS65185 / e-paper PMIC on the I²C bus to generate / source and gate driving voltages. / Touchscreen connector is also on I²C. / Intent is to use the I2S peripheral to / generate the specific waveforms required / to drive Good Display's 800x600, 4.3" / parallel e-paper display. | Solder socket header into / this side, and plug SAOLA / in on top to leave the / connectors free on bottom. | Always / On | PMIC / Control | OSO-MISC-20-017 / by joey castillo / @josecastillo / CC-BY-SA 4.0
bPlace: GND | VBUS | IO8 / EPD_GMODE2 | IO7 / EPD_D7 | IO6 / EPD_D5 | IO5 / EPD_D3 | IO4 / EPD_D1 | IO3 / EPD_SPH | IO2 / EPD_OE | IO1 / EPD_CLK | 3V3 | IO14 / TP_RST | IO13 / TP_INT | IO12 / SDA | IO11 / SCL | IO10 / EPD_CPV | IO9 / EPD_LR | OSO-MISC-20-017 / Test Board for GDE043A2 / E-Paper Display | GND | VBORDER | REQUIRED: Bodge wires / from TP1A to TP1B and / from TP2A to TP2B. | IO18 / EPD_SHR | IO19 / EPD_LE | IO33 / EPD_STV | IO34 / PWR_GOOD | IO35 / PMIC_INT | IO36 / WAKEUP | IO37 / PWRUP | IO38 / EPD_GMODE1 | IO39 / EPD_D6 | IO40 / EPD_D4 | IO41 / EPD_D2 | IO42 / EPD_D0 | GND